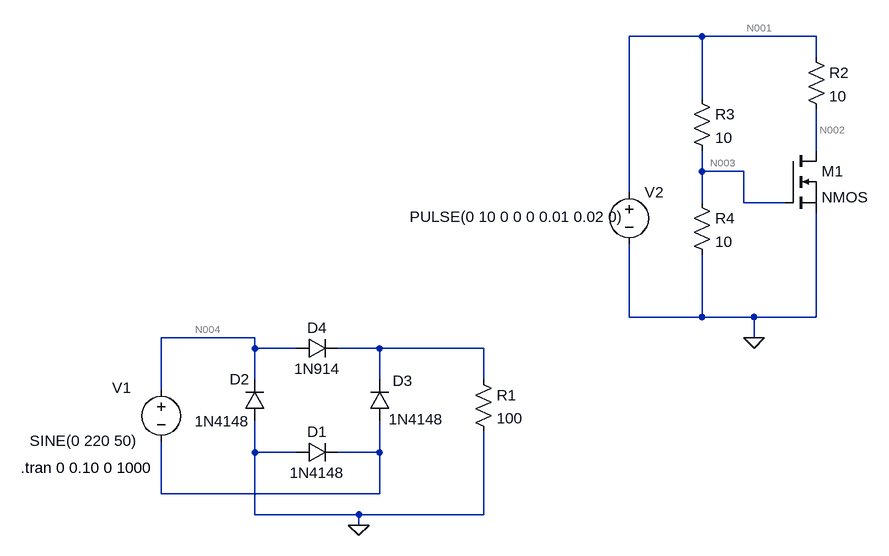
[diagram p0: schematic circuit_ver1.1.asc]
circuit_ver1.1.asc, the LTspice schematic file:
Version 4
SHEET 1 880 680
WIRE -416 -432 -528 -432
WIRE -240 -432 -416 -432
WIRE -240 -400 -240 -432
WIRE -416 -336 -416 -432
WIRE -240 -256 -240 -320
WIRE -416 -224 -416 -256
WIRE -352 -224 -416 -224
WIRE -528 -192 -528 -432
WIRE -416 -176 -416 -224
WIRE -352 -176 -352 -224
WIRE -288 -176 -352 -176
WIRE -528 0 -528 -112
WIRE -416 0 -416 -96
WIRE -416 0 -528 0
WIRE -336 0 -416 0
WIRE -240 0 -240 -160
WIRE -240 0 -336 0
WIRE -1104 32 -1248 32
WIRE -336 32 -336 0
WIRE -1104 48 -1104 32
WIRE -1040 48 -1104 48
WIRE -912 48 -976 48
WIRE -752 48 -912 48
WIRE -1104 96 -1104 48
WIRE -912 96 -912 48
WIRE -752 96 -752 48
WIRE -1248 112 -1248 32
WIRE -1104 208 -1104 160
WIRE -1040 208 -1104 208
WIRE -912 208 -912 160
WIRE -912 208 -976 208
WIRE -1248 272 -1248 192
WIRE -912 272 -912 208
WIRE -912 272 -1248 272
WIRE -1104 304 -1104 208
WIRE -944 304 -1104 304
WIRE -752 304 -752 176
WIRE -752 304 -944 304
WIRE -944 320 -944 304
FLAG -944 320 0
FLAG -336 32 0
SYMBOL voltage -1248 96 R0
WINDOW 3 -202 94 Left 2
WINDOW 123 0 0 Left 2
WINDOW 39 0 0 Left 2
WINDOW 0 -75 13 Left 2
SYMATTR Value SINE(0 220 50)
SYMATTR InstName V1
SYMBOL diode -1040 224 R270
WINDOW 0 32 32 VTop 2
WINDOW 3 0 32 VBottom 2
SYMATTR InstName D1
SYMATTR Value 1N4148
SYMBOL diode -1088 160 R180
WINDOW 0 24 64 Left 2
WINDOW 3 24 0 Left 2
SYMATTR InstName D2
SYMATTR Value 1N4148
SYMBOL diode -896 160 R180
WINDOW 0 -35 62 Left 2
WINDOW 3 -83 3 Left 2
SYMATTR InstName D3
SYMATTR Value 1N4148
SYMBOL diode -1040 64 R270
WINDOW 0 32 32 VTop 2
WINDOW 3 0 32 VBottom 2
SYMATTR InstName D4
SYMATTR Value 1N914
SYMBOL res -768 80 R0
SYMATTR InstName R1
SYMATTR Value 100
SYMBOL voltage -528 -208 R0
WINDOW 3 -338 54 Left 2
WINDOW 123 0 0 Left 2
WINDOW 39 0 0 Left 2
SYMATTR InstName V2
SYMATTR Value PULSE(0 10 0 0 0 0.01 0.02 0)
SYMBOL nmos -288 -256 R0
SYMATTR InstName M1
SYMBOL res -256 -416 R0
SYMATTR InstName R2
SYMATTR Value 10
SYMBOL res -432 -352 R0
SYMATTR InstName R3
SYMATTR Value 10
SYMBOL res -432 -192 R0
SYMATTR InstName R4
SYMATTR Value 10
TEXT -1464 232 Left 2 !.tran 0 0.10 0 1000

The netlist it stands for:
* circuit_ver1.1.asc
V1 N004 N006 SINE(0 220 50)
D1 0 N006 1N4148
D2 0 N004 1N4148
D3 N006 N005 1N4148
D4 N004 N005 1N914
R1 N005 0 100
V2 N001 0 PULSE(0 10 0 0 0 0.01 0.02 0)
M1 N002 N003 0 0 NMOS
R2 N001 N002 10
R3 N001 N003 10
R4 N003 0 10
.model D D
.lib standard.dio
.model NMOS NMOS
.model PMOS PMOS
.lib standard.mos
.tran 0 0.10 0 1000
.backanno
.end

* Results of the author's LTspice run, read from the files saved beside the schematic
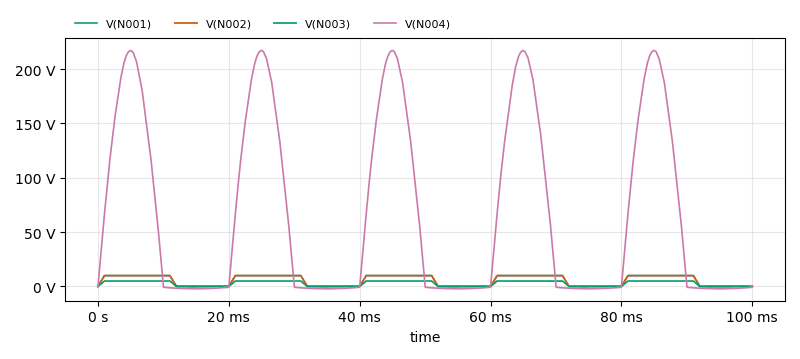
[diagram p1: Transient Analysis of circuit_ver1.1.asc, plotted from the saved traces]
* Transient Analysis, 1 run:
*   V(N001): min 0 V, max 10 V, average 5.5 V, rms 7.308 V, last 0 V
*   V(N002): min 0 V, max 9.998 V, average 5.499 V, rms 7.306 V, last 0 V
*   V(N003): min 0 V, max 5 V, average 2.75 V, rms 3.654 V, last 0 V
*   V(N004): min -2.153 V, max 217.3 V, average 67.02 V, rms 107.4 V, last -252.1 µV